# EasyEDA schematic SCH_vdk.json
TITLE: VDK PCB - Thesis; REV: 1.0; Date: 2023-01-26; Sheet: 1/1; Drawn By: Louis de Looze; Company: MDU
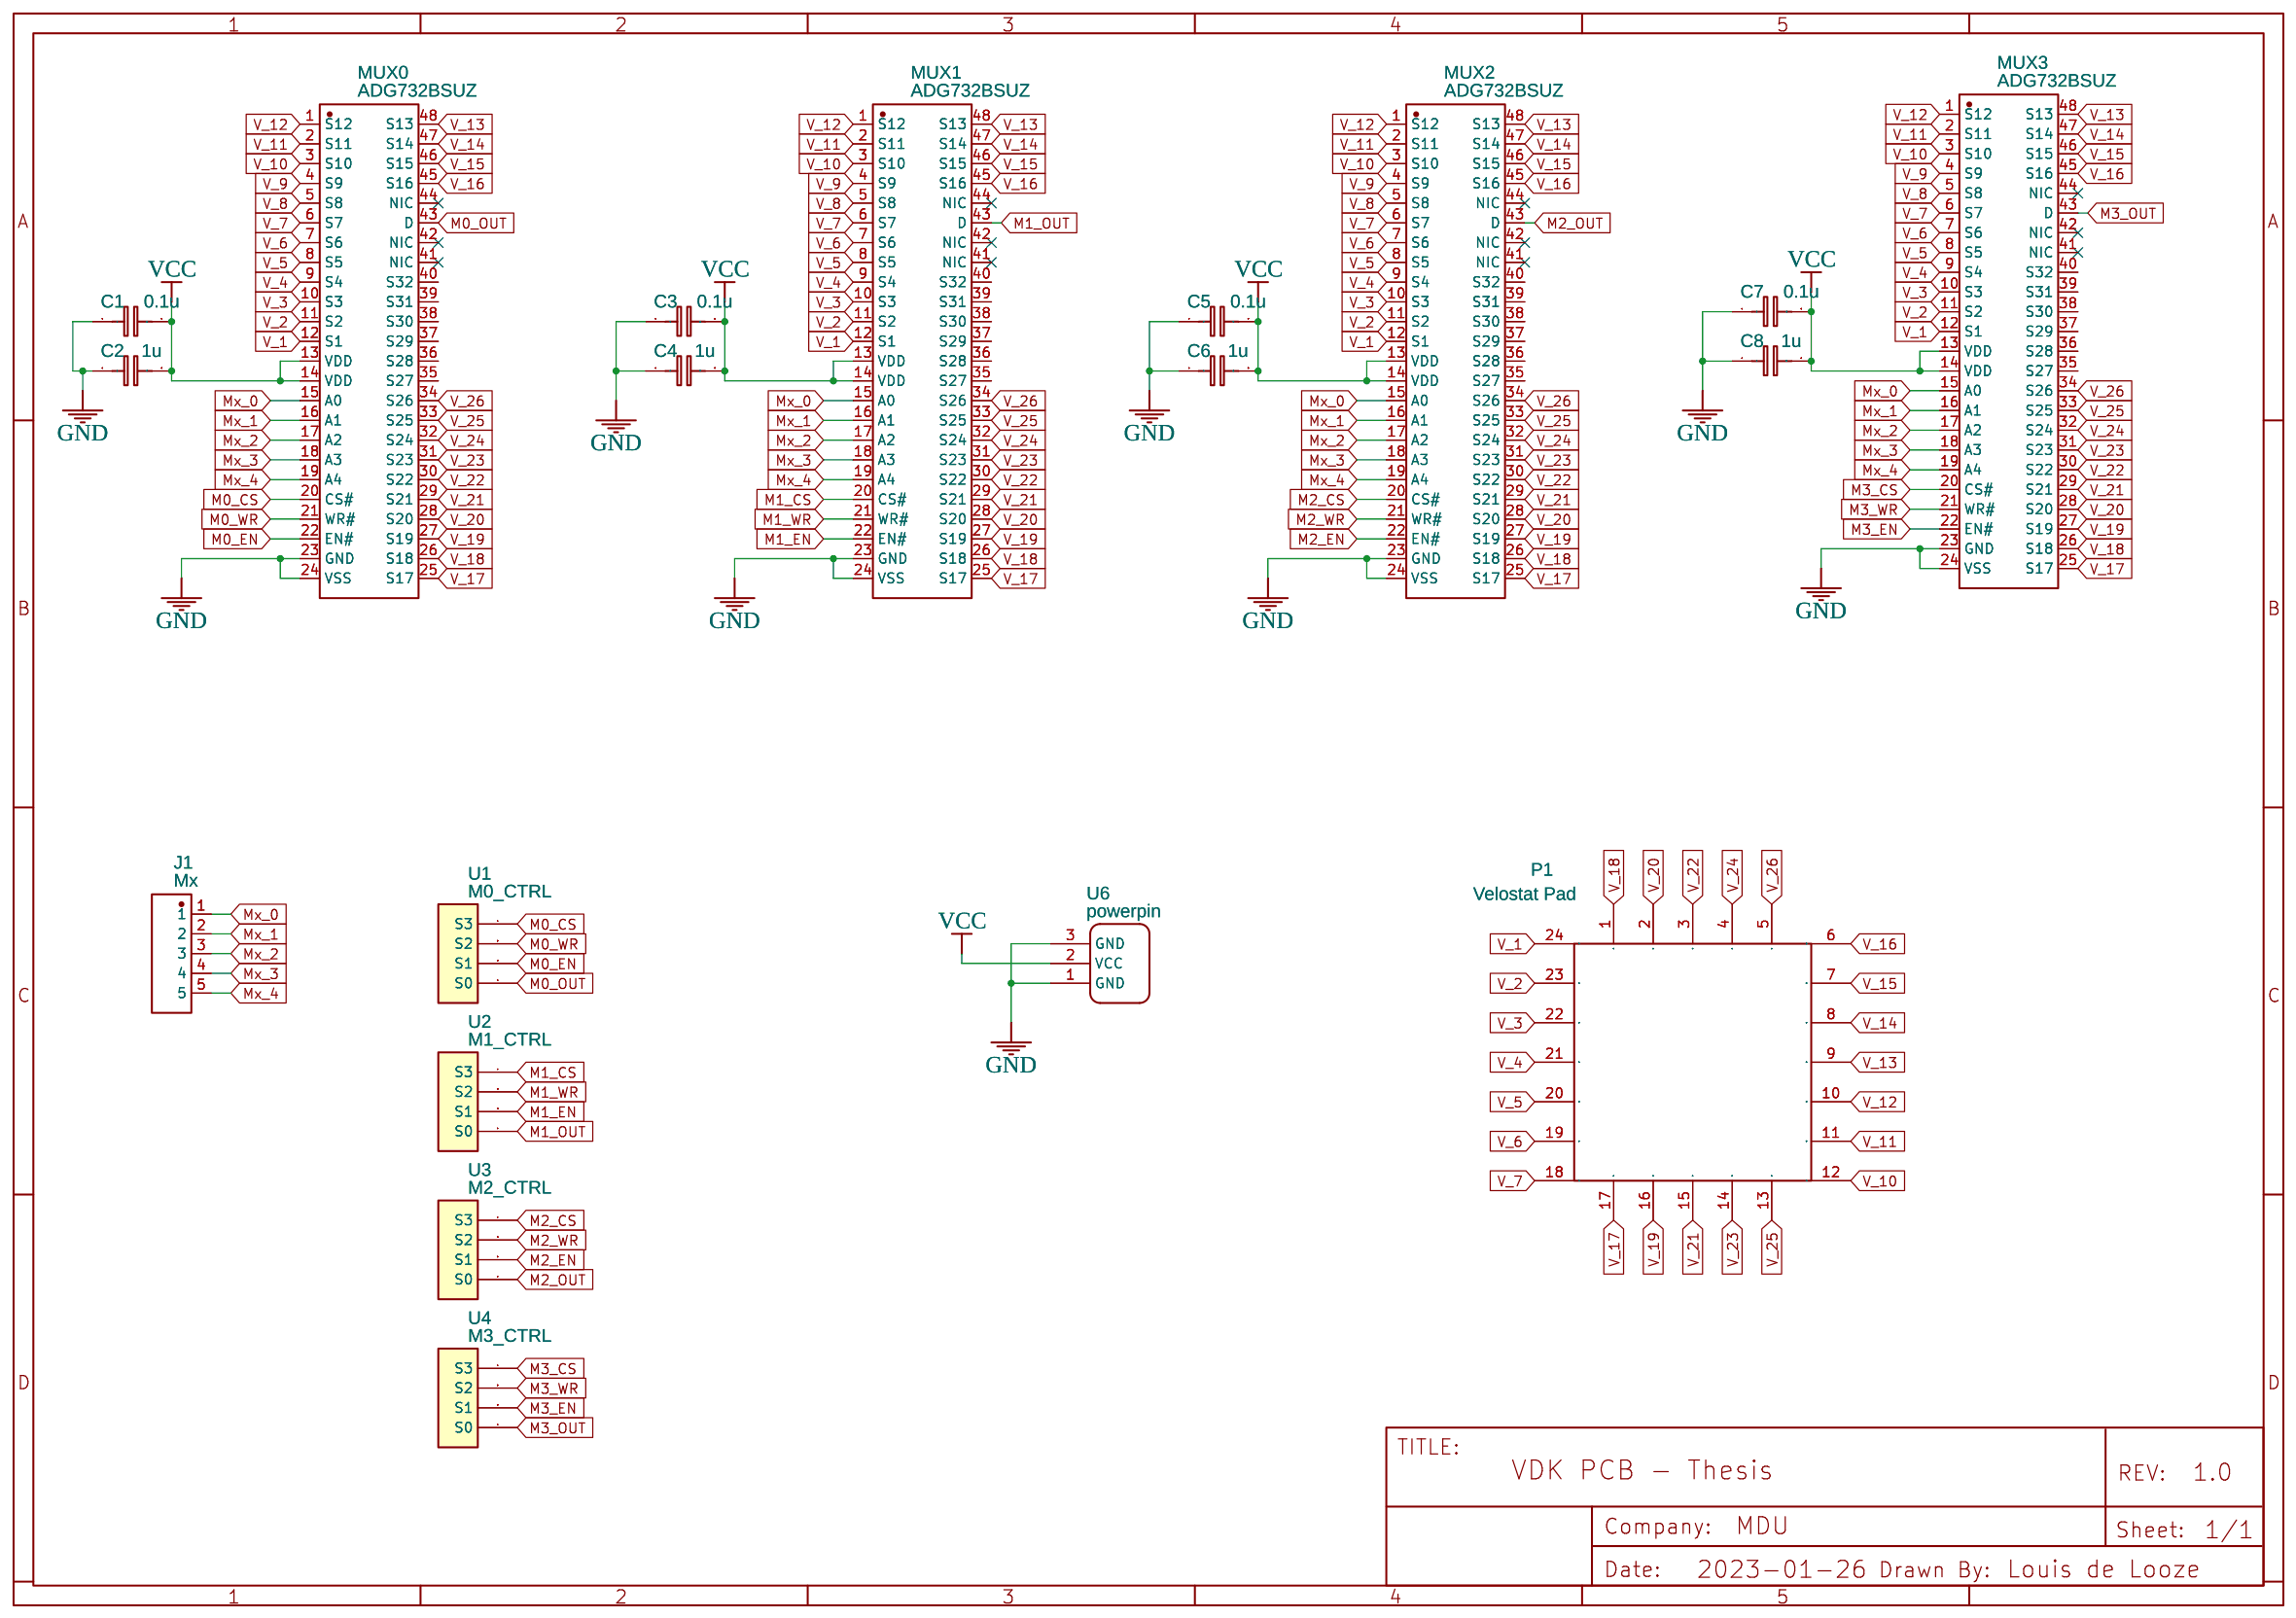
[diagram p0: schematic sheet]

## Parts
C1  0.1u  [0805]
C2  1u  [0805]
C3  0.1u  [0805]
C4  1u  [0805]
C5  0.1u  [0805]
C6  1u  [0805]
C7  0.1u  [0805]
C8  1u  [0805]
J1  Mx  [5-PIN]
MUX0  ADG732BSUZ  [TQFP-48_L7.0-W7.0-P0.50-LS9.0-TL]
MUX1  ADG732BSUZ  [TQFP-48_L7.0-W7.0-P0.50-LS9.0-TL]
MUX2  ADG732BSUZ  [TQFP-48_L7.0-W7.0-P0.50-LS9.0-TL]
MUX3  ADG732BSUZ  [TQFP-48_L7.0-W7.0-P0.50-LS9.0-TL]
P1  Velostat Pad  [VELOSTAT PAD 26MM]
U1  M0_CTRL  [4 PIN 16CH MUX CONTROL]
U2  M1_CTRL  [4 PIN 16CH MUX CONTROL]
U3  M2_CTRL  [4 PIN 16CH MUX CONTROL]
U4  M3_CTRL  [4 PIN 16CH MUX CONTROL]
U6  powerpin  [SERVO-HEADER-3PIN]

## Library data of the parts
C1-C8 = Cap_0805_EU
J1 = 5-pin: Contributor: 6Leinad6
MUX0-MUX3 = ADG732BSUZ: Supplier: LCSC; Supplier Part: C579103; Manufacturer: ADI(亚德诺)/LINEAR(凌特); link: https://atta.szlcsc.comnull; JLCPCB Part Class: Extended Part; Contributor: LCSC
P1 = Velostat Pad: Contributor: louis.delooze; Package Display: No
U1-U4 = 4 pin 16ch mux control: Manufacturer Part: New SchematicLib; Contributor: mark_0022
U6 = servo-header-3pin: Contributor: arkadiusz.wernicki

## Nets
GND: C1.1 C2.1 C3.1 C4.1 C5.1 C6.1 C7.1 C8.1 MUX0.23(GND) MUX0.24(VSS) MUX1.23(GND) MUX1.24(VSS) MUX2.23(GND) MUX2.24(VSS) MUX3.23(GND) MUX3.24(VSS) U6.1(GND) U6.3(GND)
VCC: C1.2 C2.2 C3.2 C4.2 C5.2 C6.2 C7.2 C8.2 MUX0.13(VDD) MUX0.14(VDD) MUX1.13(VDD) MUX1.14(VDD) MUX2.13(VDD) MUX2.14(VDD) MUX3.13(VDD) MUX3.14(VDD) U6.2(VCC)
M0_CS: MUX0.20(CS#) U1.4(S3)
M0_EN: MUX0.22(EN#) U1.2(S1)
M0_OUT: MUX0.43(D) U1.1(S0)
M0_WR: MUX0.21(WR#) U1.3(S2)
M1_CS: MUX1.20(CS#) U2.4(S3)
M1_EN: MUX1.22(EN#) U2.2(S1)
M1_OUT: MUX1.43(D) U2.1(S0)
M1_WR: MUX1.21(WR#) U2.3(S2)
M2_CS: MUX2.20(CS#) U3.4(S3)
M2_EN: MUX2.22(EN#) U3.2(S1)
M2_OUT: MUX2.43(D) U3.1(S0)
M2_WR: MUX2.21(WR#) U3.3(S2)
M3_CS: MUX3.20(CS#) U4.4(S3)
M3_EN: MUX3.22(EN#) U4.2(S1)
M3_OUT: MUX3.43(D) U4.1(S0)
M3_WR: MUX3.21(WR#) U4.3(S2)
Mx_0: J1.1 MUX0.15(A0) MUX1.15(A0) MUX2.15(A0) MUX3.15(A0)
Mx_1: J1.2 MUX0.16(A1) MUX1.16(A1) MUX2.16(A1) MUX3.16(A1)
Mx_2: J1.3 MUX0.17(A2) MUX1.17(A2) MUX2.17(A2) MUX3.17(A2)
Mx_3: J1.4 MUX0.18(A3) MUX1.18(A3) MUX2.18(A3) MUX3.18(A3)
Mx_4: J1.5 MUX0.19(A4) MUX1.19(A4) MUX2.19(A4) MUX3.19(A4)
V_1: MUX0.12(S1) MUX1.12(S1) MUX2.12(S1) MUX3.12(S1) P1.24(1)
V_2: MUX0.11(S2) MUX1.11(S2) MUX2.11(S2) MUX3.11(S2) P1.23(1)
V_3: MUX0.10(S3) MUX1.10(S3) MUX2.10(S3) MUX3.10(S3) P1.22(1)
V_4: MUX0.9(S4) MUX1.9(S4) MUX2.9(S4) MUX3.9(S4) P1.21(1)
V_5: MUX0.8(S5) MUX1.8(S5) MUX2.8(S5) MUX3.8(S5) P1.20(1)
V_6: MUX0.7(S6) MUX1.7(S6) MUX2.7(S6) MUX3.7(S6) P1.19(1)
V_7: MUX0.6(S7) MUX1.6(S7) MUX2.6(S7) MUX3.6(S7) P1.18(1)
V_8: MUX0.5(S8) MUX1.5(S8) MUX2.5(S8) MUX3.5(S8)
V_9: MUX0.4(S9) MUX1.4(S9) MUX2.4(S9) MUX3.4(S9)
V_10: MUX0.3(S10) MUX1.3(S10) MUX2.3(S10) MUX3.3(S10) P1.12(2)
V_11: MUX0.2(S11) MUX1.2(S11) MUX2.2(S11) MUX3.2(S11) P1.11(2)
V_12: MUX0.1(S12) MUX1.1(S12) MUX2.1(S12) MUX3.1(S12) P1.10(2)
V_13: MUX0.48(S13) MUX1.48(S13) MUX2.48(S13) MUX3.48(S13) P1.9(2)
V_14: MUX0.47(S14) MUX1.47(S14) MUX2.47(S14) MUX3.47(S14) P1.8(2)
V_15: MUX0.46(S15) MUX1.46(S15) MUX2.46(S15) MUX3.46(S15) P1.7(2)
V_16: MUX0.45(S16) MUX1.45(S16) MUX2.45(S16) MUX3.45(S16) P1.6(2)
V_17: MUX0.25(S17) MUX1.25(S17) MUX2.25(S17) MUX3.25(S17) P1.17(1)
V_18: MUX0.26(S18) MUX1.26(S18) MUX2.26(S18) MUX3.26(S18) P1.1
V_19: MUX0.27(S19) MUX1.27(S19) MUX2.27(S19) MUX3.27(S19) P1.16(1)
V_20: MUX0.28(S20) MUX1.28(S20) MUX2.28(S20) MUX3.28(S20) P1.2(1)
V_21: MUX0.29(S21) MUX1.29(S21) MUX2.29(S21) MUX3.29(S21) P1.15(1)
V_22: MUX0.30(S22) MUX1.30(S22) MUX2.30(S22) MUX3.30(S22) P1.3(1)
V_23: MUX0.31(S23) MUX1.31(S23) MUX2.31(S23) MUX3.31(S23) P1.14(1)
V_24: MUX0.32(S24) MUX1.32(S24) MUX2.32(S24) MUX3.32(S24) P1.4(1)
V_25: MUX0.33(S25) MUX1.33(S25) MUX2.33(S25) MUX3.33(S25) P1.13(1)
V_26: MUX0.34(S26) MUX1.34(S26) MUX2.34(S26) MUX3.34(S26) P1.5(1)

Not connected (* = marked no-connect by the designer): MUX0 35(S27) 36(S28) 37(S29) 38(S30) 39(S31) 40(S32) 41(NIC)* 42(NIC)* 44(NIC)*; MUX1 35(S27) 36(S28) 37(S29) 38(S30) 39(S31) 40(S32) 41(NIC)* 42(NIC)* 44(NIC)*; MUX2 35(S27) 36(S28) 37(S29) 38(S30) 39(S31) 40(S32) 41(NIC)* 42(NIC)* 44(NIC)*; MUX3 35(S27) 36(S28) 37(S29) 38(S30) 39(S31) 40(S32) 41(NIC)* 42(NIC)* 44(NIC)*
